# Altium schematic sheet OpAmp.SchDoc
size A4; CompanyName: Technische Hochschule Nürnberg Georg Simon Ohm; Organization: UltraZohm; Address1: Kesslerplatz 12; Address2: 90489 Nürnberg; Address3: GERMANY; DocumentNumber: 7; SheetNumber: 7; SheetTotal: 9; Website: www.ultrazohm.com
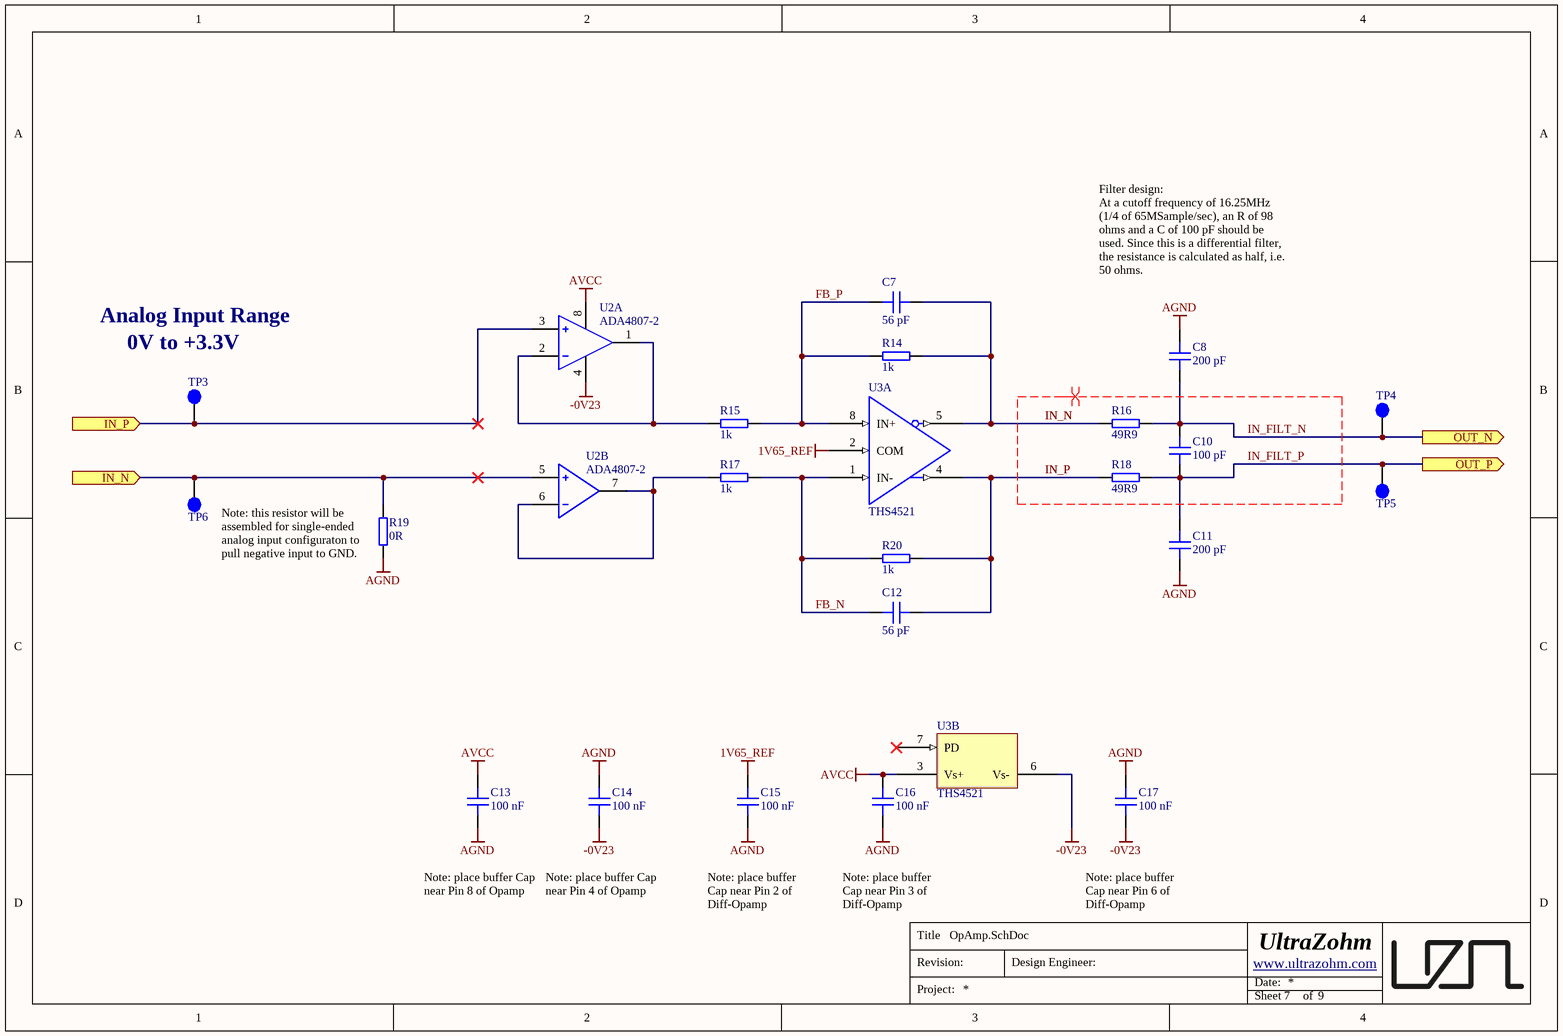
[diagram p0: OpAmp.SchDoc]

## Parts
C7  56 pF  [C_0603]
C8  200 pF  [C_0603]
C10  100 pF  [C_0603]
C11  200 pF  [C_0603]
C12  56 pF  [C_0603]
C13  100 nF  [C_0603]
C14  100 nF  [C_0603]
C15  100 nF  [C_0603]
C16  100 nF  [C_0603]
C17  100 nF  [C_0603]
R14  1k  [RES 0603_1608]
R15  1k  [RES 0603_1608]
R16  49R9  [RES 0603_1608]
R17  1k  [RES 0603_1608]
R18  49R9  [RES 0603_1608]
R19  0R  [RES 0603_1608]
R20  1k  [RES 0603_1608]
TP3  Testpoint 1mm  [TP_1mm]  (value not drawn)  (no BOM)
TP4  Testpoint 1mm  [TP_1mm]  (value not drawn)  (no BOM)
TP5  Testpoint 1mm  [TP_1mm]  (value not drawn)  (no BOM)
TP6  Testpoint 1mm  [TP_1mm]  (value not drawn)  (no BOM)
U2  ADA4807-2  [MSOP-8_IPC_B]  (parts A,B of 2)
U3  THS4521  [SOIC127P600X175-8N]  (parts A,B of 2)

## Ports
IN_N (in), IN_P (in), OUT_N (out), OUT_P (out)

## Nets
1V65_REF: C15.2 U3.2(COM)
-0V23: C14.1 C17.1 U2.4(-VS) U3.6(Vs-)
AGND: C8.2 C11.1 C13.1 C14.2 C15.1 C16.1 C17.2 R19.1
AVCC: C13.2 C16.2 U2.8(+VS) U3.3(Vs+)
FB_N: C12.1 R17.2 R20.1 U3.1(IN-)
FB_P: C7.1 R14.1 R15.2 U3.8(IN+)
IN_FILT_N: C8.1 C10.2 R16.2 TP4.1 ; port OUT_N
IN_FILT_P: C10.1 C11.2 R18.2 TP5.1 ; port OUT_P
IN_N: C7.2 R14.2 R16.1 U3.5(OUT-)
IN_N: R19.2 TP6.1 U2.5(+IN2) ; port IN_N  [a separate net that carries the same name]
IN_P: C12.2 R18.1 R20.2 U3.4(OUT+)
IN_P: TP3.1 U2.3(+IN1) ; port IN_P  [a separate net that carries the same name]
NetR15_1: R15.1 U2.1(VOUT1) U2.2(-IN1)
NetR17_1: R17.1 U2.6(-IN2) U2.7(VOUT2)

Not connected (* = marked no-connect by the designer): U3 7(PD)*

## Layout directives
differential pair: IN_FILT_N, IN_FILT_P, IN_N, IN_P

## Notes on the sheet
- Filter design:
  At a cutoff frequency of 16.25MHz (1/4 of 65MSample/sec), an R of 98 ohms and a C of 100 pF should be used. Since this is a differential filter, the resistance is calculated as half, i.e. 50 ohms.
- Analog Input Range
- (near TP3) 0V to +3.3V
- (near R19) Note: this resistor will be assembled for single-ended analog input configuraton to pull negative input to GND.
- Note: place buffer Cap near Pin 8 of Opamp
- Note: place buffer Cap near Pin 4 of Opamp
- Note: place buffer Cap near Pin 2 of Diff-Opamp
- Note: place buffer Cap near Pin 3 of Diff-Opamp
- Note: place buffer Cap near Pin 6 of Diff-Opamp
- Title
- Revision:
- Design Engineer:
- Date:
- Project:
- Sheet
- of

## Library data of the parts
C7 C12 = CL10C560JB8NNNC: Capacitor 0603, 50 VDC, 56 pF, C0G; Manufacturer: Samsung Electro-Mechanics; Tolerance: 5 %; Voltage Rating: 50 VDC; Created from: DHufnagel; Manufacturer Part Number: CL10C560JB8NNNC; PartID: 92; Created On: 20.12.2020 13:54:13; ComponentLink1Description: Datasheet; ComponentLink1URL: https://www.mouser.de/datasheet/2/585/MLCC-1837944.pdf; Component Type: Capacitor 0603; Device Package: 0603; Last Updated: 20.12.2020 16:24:16; Mounting Type: SMD; Operating Temperature: -55 - 125°C; Series: CL; Supplier 1: Mouser; Supplier Part Number 1: 187-CL10C560JB8NNNC; Supplier 2: LCSC; Supplier Part Number 2: C39148; Type: Capacitor; Value: 56 pF; Live Cycle Status: 1; LCSC Part Number: C39148; Stock number: not stored
C8 C11 = 0603B201K500NT: 50V 200pF X7R ±10% 0603  Multilayer Ceramic Capacitors MLCC - SMD/SMT ROHS; Manufacturer: FH (Guangdong Fenghua Advanced Tech); Voltage Rating: 50 VDC; Created from: AGeiger; Manufacturer Part Number: 0603B201K500NT; PartID: 105; Created On: 03.09.2022 10:50:43; ComponentLink1Description: Datasheet; ComponentLink1URL: https://datasheet.lcsc.com/lcsc/1811061810_FH--Guangdong-Fenghua-Advanced-Tech-0603B201K500NT_C1600.pdf; Component Type: Capacitor 0603; Device Package: 0603; Last Updated: 03.09.2022 10:50:43; Mounting Type: SMD; Operating Temperature: -55 - 125°C; Series: X7R; Supplier 1: LCSC; Supplier Part Number 1: C1600; Type: Capacitor; Tolerance: 10 %; Value: 200 pF; Live Cycle Status: 1; LCSC Part Number: C1600
C10 = CL10C101JB8NNNC: 50V 100pF C0G ±5% 0603 Multilayer Ceramic Capacitors MLCC - SMD/SMT ROHS; Manufacturer: Samsung Electro-Mechanics; Voltage Rating: 50 VDC; Created from: AGeiger; Manufacturer Part Number: CL10C101JB8NNNC; PartID: 106; Created On: 03.09.2022 10:55:28; ComponentLink1Description: Datasheet; ComponentLink1URL: https://datasheet.lcsc.com/lcsc/1811151136_Samsung-Electro-Mechanics-CL10C101JB8NNNC_C14858.pdf; Component Type: Capacitor 0603; Device Package: 0603; Last Updated: 03.09.2022 10:55:28; Mounting Type: SMD; Operating Temperature: -55 - 125°C; Series: C0G; Supplier 1: LCSC; Supplier Part Number 1: C14858; Type: Capacitor; Tolerance: 5 %; Value: 100 pF; Live Cycle Status: 1; LCSC Part Number: C14858
C13-C17 = CC0603KRX7R9BB104: Capacitor 0603, 50 VDC, 100 nF, X7R; Manufacturer: YAGEO; Tolerance: 10 %; Voltage Rating: 50 VDC; Created from: AGeiger; Manufacturer Part Number: CC0603KRX7R9BB104; PartID: 102; Created On: 22.08.2022 14:35:53; ComponentLink1Description: Datasheet; ComponentLink1URL: https://datasheet.lcsc.com/lcsc/1809301912_YAGEO-CC0603KRX7R9BB104_C14663.pdf; Component Type: Capacitor 0603; Device Package: 0603; Last Updated: 22.08.2022 14:35:53; Mounting Type: SMD; Operating Temperature: -55 - 125°C; Series: X7R; Supplier 1: LCSC; Supplier Part Number 1: C14663; Supplier 2: Mouser; Supplier Part Number 2: 603-CC603KRX7R9BB104; Type: Capacitor; Value: 100 nF; Live Cycle Status: 1; LCSC Part Number: C14663
R14 R15 R17 R20 = AR03BTCX1001: 100mW ±0.1% ±25ppm/℃ 1kΩ 0603 Chip Resistor - Surface Mount ROHS; Manufacturer: Viking Tech; Created from: AGeiger; Manufacturer Part Number: AR03BTCX1001; PartID: 240; Created On: 03.09.2022 10:12:43; ComponentLink1Description: Datasheet; ComponentLink1URL: https://datasheet.lcsc.com/lcsc/2011191435_Viking-Tech-AR03BTCX1001_C304069.pdf; Component Type: SMD resistor; Device Package: 0603; Last Updated: 03.09.2022 10:12:43; Mounting Type: SMD; Supplier 1: LCSC; Supplier Part Number 1: C304069; Type: Resistor; Tolerance: 0.1%; Value: 1k; Live Cycle Status: 1; LCSC Part Number: C304069
R16 R18 = RK73H1JTTD49R9F: SMD resistor 1%; Manufacturer: KOA Speer; Created from: DHufnagel; Manufacturer Part Number: RK73H1JTTD49R9F; PartID: 214; Created On: 14.12.2020 16:17:14; ComponentLink1Description: Datasheet; ComponentLink1URL: https://www.mouser.de/datasheet/2/219/RK73H-1825326.pdf; Component Type: SMD resistor; Device Package: 0603; Last Updated: 27.05.2022 13:46:35; Mounting Type: SMD; Supplier 1: Mouser; Supplier Part Number 1: 660-RK73H1JTTD49R9F; Supplier 2: LCSC; Supplier Part Number 2: C160046; Type: Resistor; Tolerance: 1%; Value: 49R9; Live Cycle Status: 1; Stock number: not stored; LCSC Part Number: C160046
R19 = RC0603JR-070RL: SMD resistor E24 series; Manufacturer: YAGEO; Tolerance: 5%; Created from: MGremer; Manufacturer Part Number: RC0603JR-070RL; PartID: 1; Created On: 14.12.2020 16:17:14; ComponentLink1Description: Datasheet; ComponentLink1URL: https://www.mouser.de/datasheet/2/447/PYu-RC_Group_51_RoHS_L_10-1664068.pdf; Component Type: SMD resistor; Device Package: 0603; Last Updated: 04.03.2021 09:09:42; Mounting Type: SMD; Supplier 1: Mouser; Supplier Part Number 1: 603-RC0603JR-070RL; Supplier 2: LCSC; Supplier Part Number 2: C21189; Type: Resistor; Value: 0R; Live Cycle Status: 1; Stock number: Labor SMD Container; LCSC Part Number: C21189
TP3-TP6 = NULL: Manufacturer Part Number: NULL; Created from: AGeiger; Created: 2018_06_25_AGeiger; Value: Testpoint 1mm; PartID: 9; Created On: 20.09.2022 13:14:57; Component Type: Testpoint; Last Updated: 20.09.2022 13:15:39; Manufacturer: NULL; Supplier 1: NULL; Supplier Part Number 1: NULL; Type: Testpoint; Live Cycle Status: 1
U2 = ADA4807-2ARMZ-R7: 180 MHz, Rail-to-Rail Input/Output Amplifiers; Manufacturer: Analog Devices; Channels: 2; GBP: 180 MHz; Created from: AGeiger; Manufacturer Part Number: ADA4807-2ARMZ-R7; PartID: 16; Created On: 27.10.2022 12:26:50; ComponentLink1Description: Datasheet; ComponentLink1URL: https://datasheet.lcsc.com/lcsc/2101281739_Analog-Devices-ADA4807-2ARMZ-R7_C578928.pdf; Component Type: Operational Amplifier; Device Package: MSOP-8; Last Updated: 23.11.2022 15:27:24; Mounting Type: SMD; Operating Temperature: -40 to +125°C; Series: ADA4807; Supplier 1: LCSC; Supplier Part Number 1: C578928; Type: OpAmp; Value: ADA4807-2; Live Cycle Status: 1; LCSC Part Number: C578928
U3 = THS4521IDR: THS452x Very Low Power, Negative Rail Input, Rail-To-Rail Output, Fully Differential Amplifier; Manufacturer: Texas Instruments; Channels: 1; GBP: 145 MHz; Created from: AGeiger; Manufacturer Part Number: THS4521IDR; PartID: 15; Created On: 03.09.2022 09:19:34; ComponentLink1Description: Datasheet; ComponentLink1URL: https://www.ti.com/cn/lit/ds/symlink/ths4521.pdf?ts=1662191143470; Component Type: Differential Amplifier; Device Package: SOIC-8; Last Updated: 03.09.2022 09:22:56; Mounting Type: SMD; Operating Temperature: -40 to 85 °C; Series: THS4521; Supplier 1: LCSC; Supplier Part Number 1: C16092; Type: Differential Amplifiers; Value: THS4521; Live Cycle Status: 1; LCSC Part Number: C16092